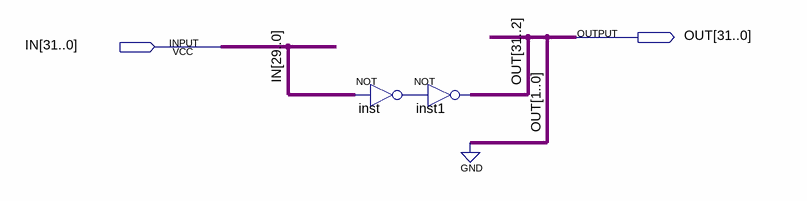
[diagram p0: schematic sheet]
// Quartus schematic leftshift.bdf as structural Verilog: 2 symbols, 2 pins
module leftshift (
  input  [31:0] IN,
  output [31:0] OUT
);

  wire inst_out;

  assign inst_out = ~IN[29:0];  // NOT inst, 30 bits wide
  assign OUT[31:2] = ~{30{inst_out}};  // NOT inst1, 30 bits wide

  assign OUT[1:0] = 2'b00;
endmodule
